# EAGLE design POVDisplayRoateBasic (EAGLE 7.4.0)
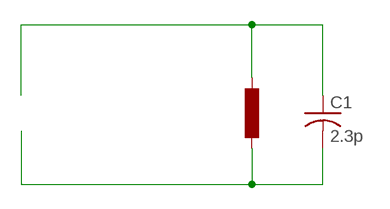
[diagram p0: schematic, sheet 1]
L1 (L): INDUCTANCE: 36.2uH

## Parts
C1  2.3p  C-USC1210  [C1210]

## Nets
NEG_COIL: C1.2
POS_COIL: C1.1

## Library data of the parts
C1 = resistor:C-US: CAPACITOR, American symbol

## Board
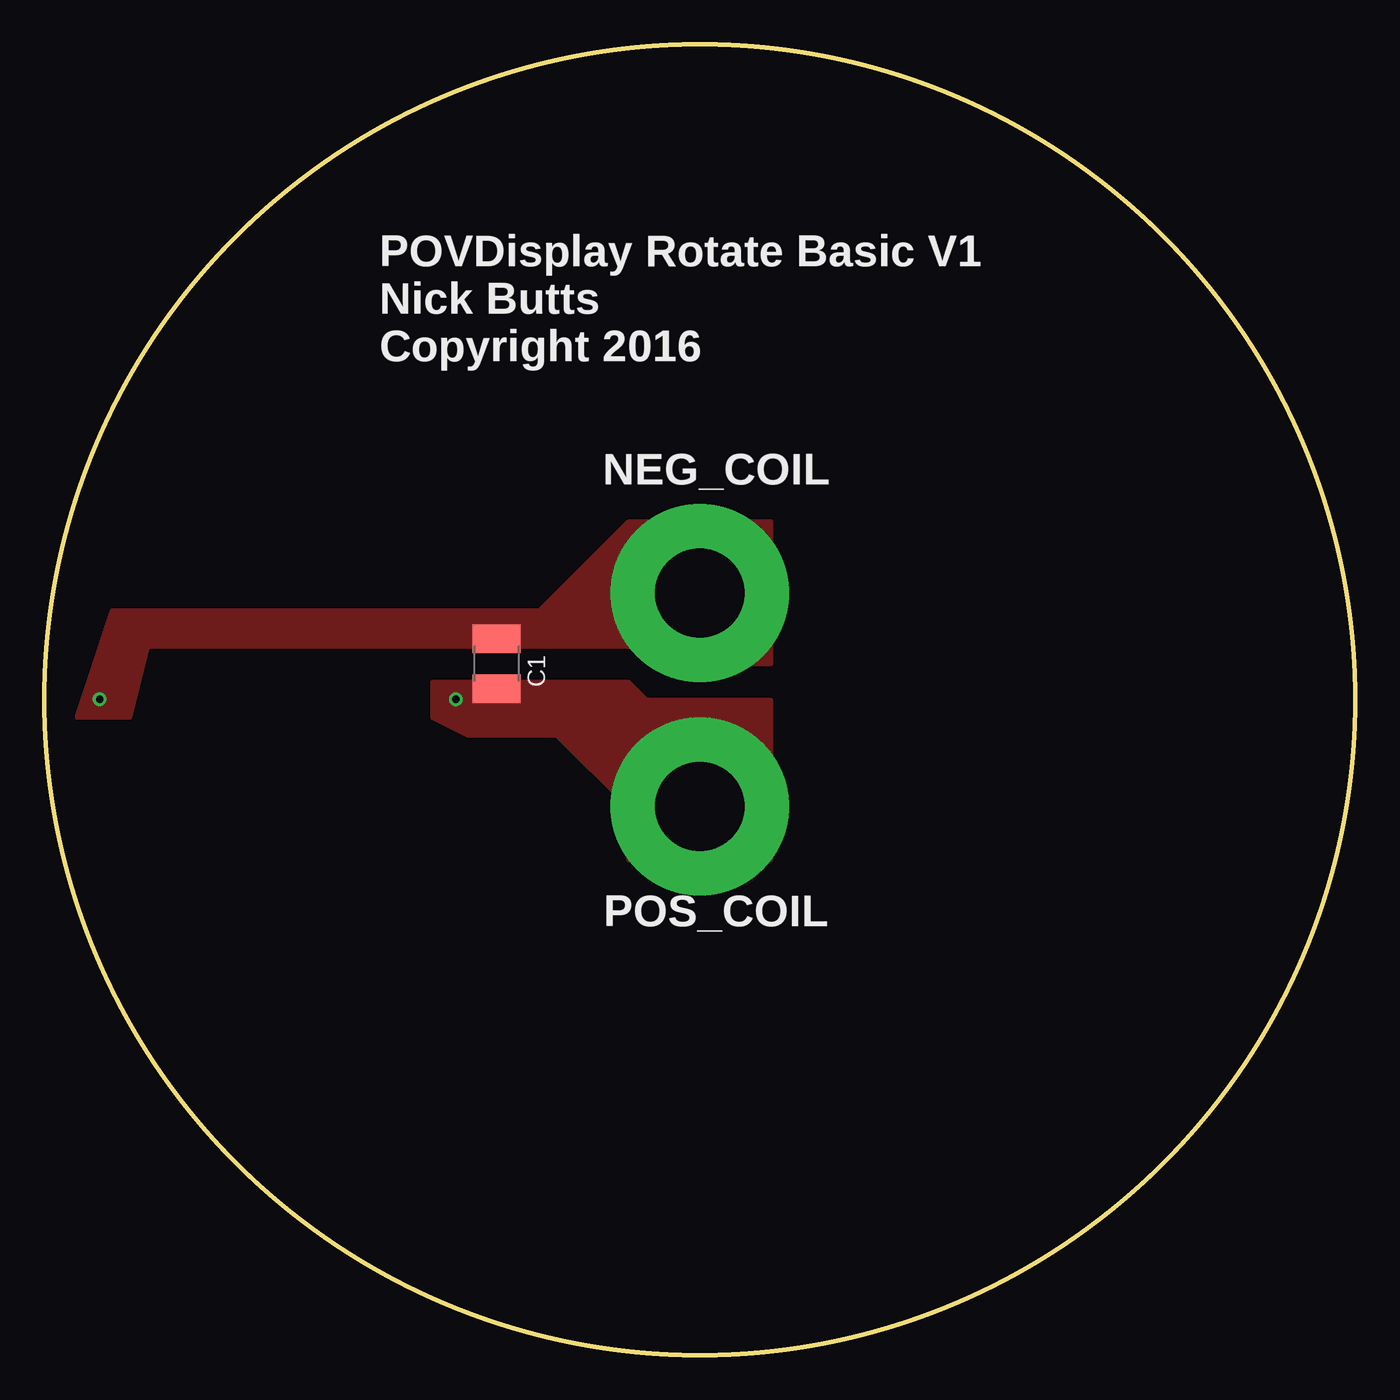
[diagram p1: board, top side]
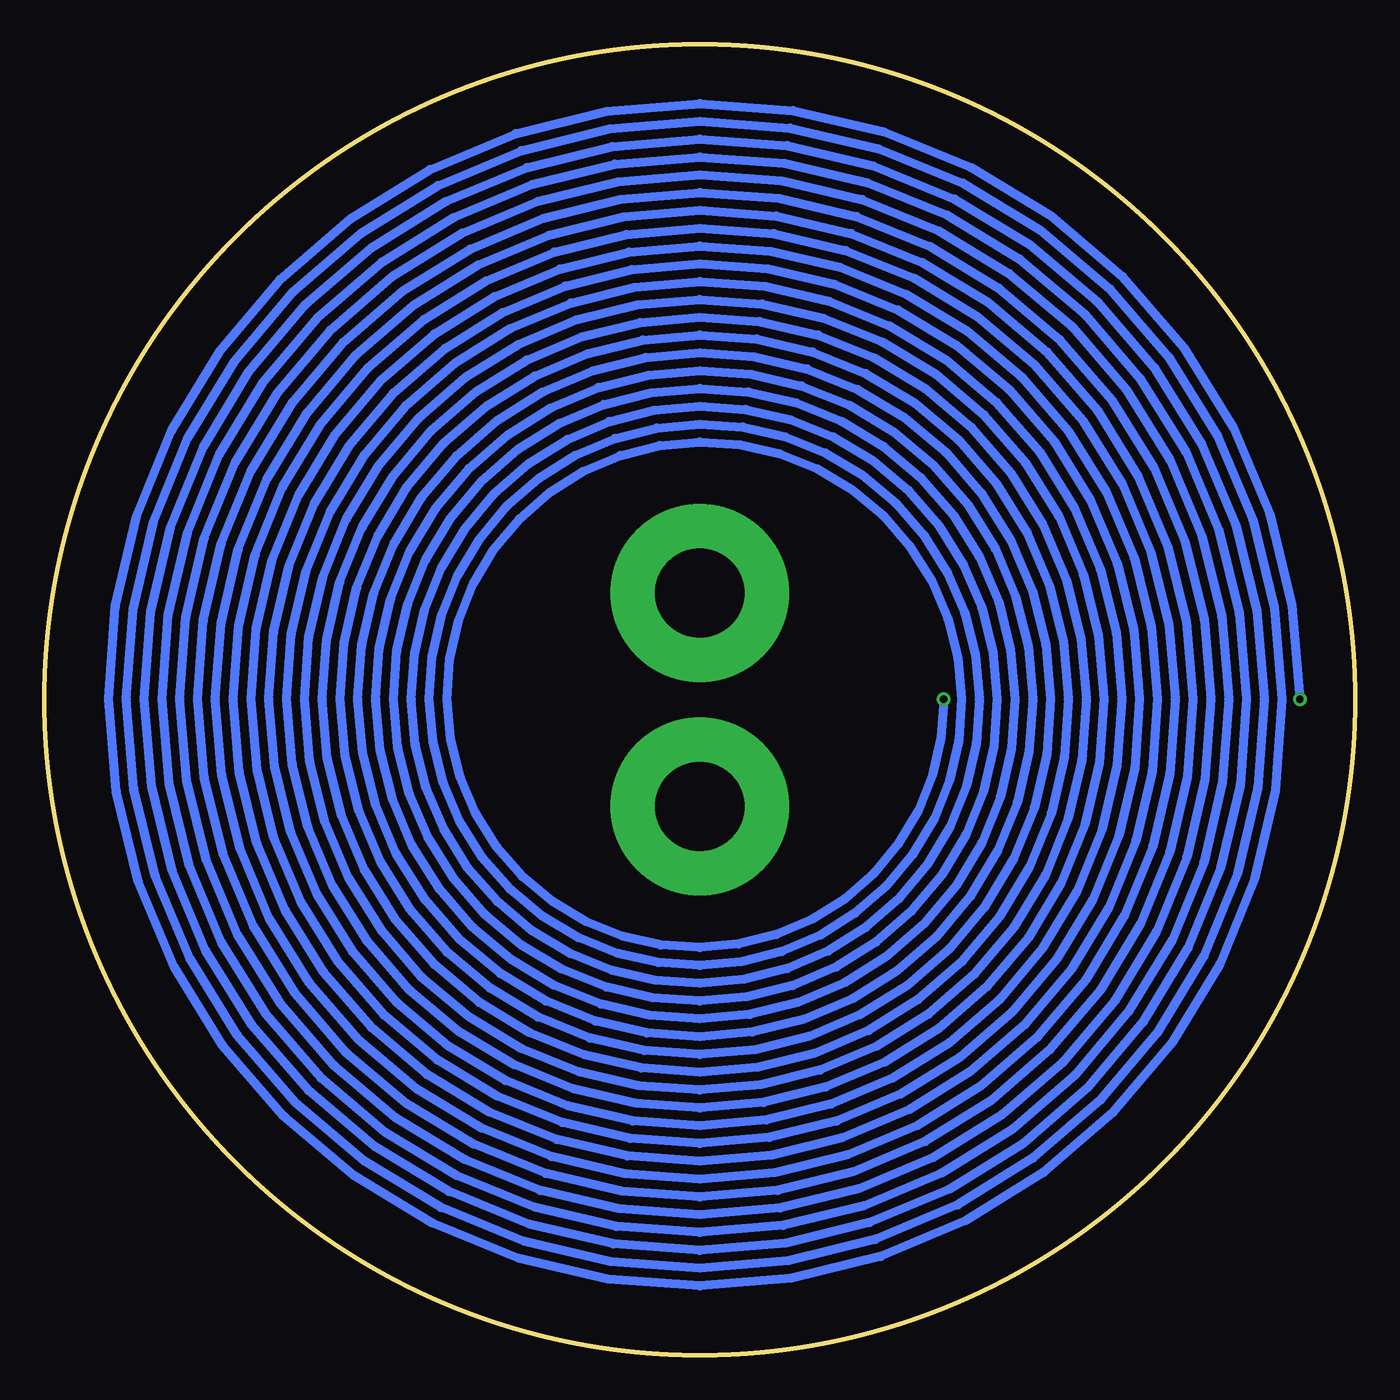
[diagram p2: board, bottom side, seen from below]

Size 73.59 x 73.59 mm. Coordinates in mm from the lower left corner, seen from the top.
Outline: circle at 36.8,36.8 radius 36.8
Copper layers (1*16): Top 0.0356mm / dielectric 1.5011mm / Bottom 0.0356mm
Design rules "oshpark-2layer": minimum track width 6mil, minimum drill 13mil, track to track 6mil, track to pad 6mil, pad to pad 6mil, via to via 6mil, smd to smd 6mil, copper to edge 15mil, drill to drill 6mil, minimum pad ring 7mil, minimum via ring 7mil, stop-mask expansion 4mil, vias tented up to drill 0mil, thermal gap 10mil

### Footprints (pad centres in the part's own frame; a part is rotated, then mirrored left to right if it is on the bottom)
C1210 = smd 1.6 x 2.7: 1 -1.4,0; 2 1.4,0

### Placement (x,y rotation side)
C1  25.4,38.83 90 top

### Tracks (layer width: path | path; a pad name or v marks a point on that pad's centre or on a via)
NEG_COIL  (via drill 0.4 pad 0.5, 5 pad 10)
  Bottom 0.5: v23.1,36.83 23.24,34.68 23.72,32.58 24.52,30.57 25.63,28.72 27.02,27.05 28.66,25.62 30.5,24.46 32.5,23.61 34.62,23.07 36.8,22.88 38.98,23.02 41.12,23.51 43.16,24.33 45.05,25.46 46.75,26.87 48.2,28.54 49.38,30.41 50.25,32.45 50.8,34.61 51,36.83 50.85,39.05 50.35,41.23 49.52,43.31 48.37,45.23 46.93,46.96 45.23,48.44 43.32,49.63 41.25,50.52 39.05,51.07 36.8,51.28 34.53,51.12 32.32,50.62 30.2,49.77 28.24,48.6 26.49,47.13 24.98,45.41 23.77,43.47 22.86,41.35 22.3,39.12 22.1,36.83 22.25,34.52 22.77,32.27 23.63,30.12 24.82,28.13 26.31,26.34 28.07,24.81 30.04,23.57 32.19,22.66 34.46,22.09 36.8,21.88 39.14,22.04 41.43,22.56 43.62,23.44 45.64,24.65 47.46,26.17 49.01,27.95 50.27,29.96 51.2,32.14 51.78,34.45 52,36.83 51.83,39.21 51.3,41.54 50.41,43.76 49.17,45.82 47.63,47.66 45.82,49.24 43.78,50.53 41.56,51.47 39.21,52.06 36.8,52.28 34.38,52.11 32.01,51.57 29.75,50.66 27.66,49.41 25.78,47.84 24.18,46 22.87,43.92 21.91,41.66 21.31,39.28 21.1,36.83 21.27,34.37 21.82,31.96 22.74,29.66 24.01,27.54 25.61,25.64 27.48,24 29.59,22.68 31.88,21.7 34.31,21.1 36.8,20.88 39.3,21.05 41.74,21.61 44.07,22.55 46.23,23.84 48.16,25.46 49.82,27.36 51.16,29.51 52.16,31.84 52.77,34.3 53,36.83 52.82,39.36 52.25,41.85 51.3,44.22 49.98,46.41 48.34,48.37 46.41,50.05 44.23,51.42 41.86,52.42 39.37,53.05 36.8,53.28 34.22,53.1 31.7,52.52 29.29,51.55 27.07,50.22 25.08,48.55 23.37,46.58 21.98,44.37 20.96,41.97 20.33,39.44 20.1,36.83 20.28,34.21 20.87,31.65 21.85,29.21 23.21,26.95 24.9,24.93 26.89,23.19 29.14,21.79 31.57,20.75 34.15,20.11 36.8,19.88 39.45,20.06 42.05,20.66 44.53,21.66 46.82,23.03 48.87,24.75 50.63,26.78 52.05,29.05 53.11,31.53 53.76,34.14 54,36.83 53.81,39.52 53.2,42.16 52.19,44.67 50.79,47 49.05,49.08 46.99,50.86 44.68,52.31 42.17,53.37 39.52,54.04 36.8,54.28 34.06,54.09 31.39,53.47 28.84,52.44 26.48,51.02 24.37,49.25 22.56,47.17 21.09,44.83 20.01,42.28 19.34,39.59 19.1,36.83 19.29,34.05 19.92,31.34 20.96,28.76 22.4,26.36 24.19,24.22 26.3,22.39 28.68,20.9 31.27,19.8 33.99,19.12 36.8,18.88 39.61,19.07 42.36,19.71 44.98,20.77 47.41,22.22 49.58,24.05 51.44,26.19 52.95,28.6 54.06,31.22 54.75,33.98 55,36.83 54.8,39.68 54.15,42.47 53.08,45.12 51.6,47.58 49.75,49.78 47.58,51.67 45.14,53.2 42.48,54.33 39.68,55.02 36.8,55.28 33.91,55.07 31.08,54.42 28.39,53.33 25.89,51.83 23.66,49.96 21.75,47.76 20.2,45.28 19.06,42.59 18.35,39.75 18.1,36.83 18.3,33.9 18.96,31.03 20.07,28.3 21.59,25.78 23.49,23.52 25.72,21.58 28.23,20.01 30.96,18.85 33.84,18.13 36.8,17.88 39.76,18.09 42.67,18.76 45.43,19.88 47.99,21.41 50.28,23.34 52.25,25.6 53.84,28.14 55.01,30.91 55.74,33.83 56,36.83 55.78,39.83 55.1,42.78 53.97,45.58 52.41,48.17 50.46,50.49 48.17,52.48 45.59,54.09 42.79,55.28 39.84,56.01 36.8,56.28 33.75,56.06 30.77,55.37 27.93,54.22 25.31,52.64 22.95,50.67 20.94,48.35 19.31,45.74 18.11,42.9 17.36,39.9 17.1,36.83 17.31,33.74 18.01,30.72 19.18,27.85 20.78,25.19 22.78,22.81 25.13,20.77 27.77,19.12 30.65,17.9 33.68,17.15 36.8,16.88 39.92,17.1 42.98,17.81 45.89,18.98 48.58,20.61 50.99,22.63 53.06,25.01 54.73,27.69 55.96,30.6 56.72,33.67 57,36.83 56.77,39.99 56.06,43.08 54.86,46.03 53.22,48.76 51.17,51.2 48.76,53.29 46.05,54.98 43.1,56.23 39.99,57 36.8,57.28 33.59,57.05 30.46,56.32 27.48,55.11 24.72,53.45 22.25,51.38 20.13,48.93 18.42,46.19 17.16,43.21 16.38,40.06 16.1,36.83 16.33,33.58 17.06,30.41 18.29,27.39 19.97,24.6 22.07,22.1 24.54,19.96 27.32,18.23 30.34,16.95 33.52,16.16 36.8,15.88 40.08,16.11 43.29,16.85 46.34,18.09 49.17,19.8 51.7,21.92 53.87,24.42 55.62,27.24 56.91,30.29 57.71,33.51 58,36.83 57.76,40.15 57.01,43.39 55.75,46.49 54.03,49.35 51.88,51.91 49.35,54.1 46.5,55.87 43.41,57.18 40.15,57.99 36.8,58.28 33.44,58.04 30.15,57.27 27.02,56.01 24.13,54.26 21.54,52.08 19.32,49.52 17.53,46.64 16.21,43.52 15.39,40.22 15.1,36.83 15.34,33.43 16.11,30.11 17.39,26.94 19.16,24.01 21.36,21.39 23.95,19.15 26.87,17.34 30.03,16 33.37,15.17 36.8,14.88 40.23,15.12 43.59,15.9 46.8,17.2 49.76,18.99 52.41,21.22 54.68,23.84 56.51,26.78 57.86,29.98 58.7,33.36 59,36.83 58.75,40.3 57.96,43.7 56.64,46.94 54.84,49.93 52.58,52.61 49.93,54.91 46.95,56.76 43.72,58.13 40.3,58.98 36.8,59.28 33.28,59.02 29.84,58.23 26.57,56.9 23.54,55.07 20.83,52.79 18.51,50.11 16.64,47.1 15.26,43.83 14.4,40.37 14.1,36.83 14.35,33.27 15.16,29.8 16.5,26.49 18.35,23.43 20.66,20.69 23.37,18.34 26.41,16.44 29.72,15.05 33.21,14.18 36.8,13.88 40.39,14.13 43.9,14.95 47.25,16.31 50.34,18.18 53.11,20.51 55.48,23.25 57.4,26.33 58.81,29.67 59.69,33.2 60,36.83 59.74,40.46 58.91,44.01 57.53,47.39 55.65,50.52 53.29,53.32 50.52,55.72 47.41,57.65 44.03,59.08 40.46,59.96 36.8,60.28 33.12,60.01 29.53,59.18 26.12,57.79 22.95,55.88 20.13,53.5 17.7,50.7 15.75,47.55 14.3,44.13 13.41,40.53 13.1,36.83 13.36,33.12 14.21,29.49 15.61,26.03 17.54,22.84 19.95,19.98 22.78,17.53 25.96,15.55 29.41,14.1 33.05,13.2 36.8,12.88 40.55,13.15 44.21,14 47.7,15.42 50.93,17.37 53.82,19.8 56.29,22.66 58.29,25.87 59.76,29.36 60.67,33.04 61,36.83 60.72,40.62 59.86,44.32 58.43,47.85 56.46,51.11 54,54.03 51.11,56.53 47.86,58.54 44.34,60.03 40.62,60.95 36.8,61.28 32.97,61 29.23,60.13 25.66,58.68 22.37,56.69 19.42,54.2 16.89,51.29 14.86,48.01 13.35,44.44 12.43,40.69 12.1,36.83 12.38,32.96 13.26,29.18 14.72,25.58 16.73,22.25 19.24,19.27 22.19,16.72 25.5,14.66 29.1,13.15 32.9,12.21 36.8,11.88 40.7,12.16 44.52,13.05 48.16,14.53 51.52,16.56 54.53,19.1 57.1,22.07 59.18,25.42 60.72,29.05 61.66,32.89 62,36.83 61.71,40.77 60.81,44.63 59.32,48.3 57.26,51.7 54.7,54.73 51.7,57.34 48.32,59.44 44.65,60.98 40.77,61.94 36.8,62.28 32.81,61.99 28.92,61.08 25.21,59.57 21.78,57.5 18.71,54.91 16.09,51.87 13.96,48.46 12.4,44.75 11.44,40.84 11.1,36.83 11.39,32.8 12.31,28.87 13.83,25.12 15.92,21.66 18.54,18.57 21.6,15.91 25.05,13.77 28.79,12.19 32.74,11.22 36.8,10.88 40.86,11.17 44.83,12.1 48.61,13.64 52.11,15.75 55.23,18.39 57.91,21.49 60.07,24.97 61.67,28.75 62.65,32.73 63,36.83 62.7,40.93 61.76,44.94 60.21,48.76 58.07,52.29 55.41,55.44 52.28,58.14 48.77,60.33 44.95,61.93 40.93,62.93 36.8,63.28 32.65,62.98 28.61,62.03 24.75,60.46 21.19,58.31 18.01,55.62 15.28,52.46 13.07,48.91 11.45,45.06 10.45,41 10.1,36.83 10.4,32.65 11.36,28.56 12.94,24.67 15.11,21.07 17.83,17.86 21.01,15.1 24.6,12.88 28.48,11.24 32.58,10.23 36.8,9.88 41.02,10.18 45.14,11.15 49.07,12.75 52.7,14.94 55.94,17.68 58.72,20.9 60.97,24.51 62.62,28.44 63.64,32.58 64,36.83 63.69,41.09 62.71,45.25 61.1,49.21 58.88,52.87 56.12,56.15 52.87,58.95 49.22,61.22 45.26,62.89 41.09,63.91 36.8,64.28 32.5,63.96 28.3,62.98 24.3,61.35 20.6,59.11 17.3,56.32 14.47,53.05 12.18,49.37 10.5,45.37 9.46,41.16 9.1,36.83 9.41,32.49 10.4,28.25 12.05,24.22 14.31,20.49 17.12,17.15 20.43,14.3 24.14,11.99 28.17,10.29 32.43,9.25 36.8,8.88 41.17,9.2 45.45,10.2 49.52,11.86 53.28,14.13 56.65,16.97 59.53,20.31 61.86,24.06 63.57,28.13 64.62,32.42 65,36.83 64.67,41.24 63.66,45.56 61.99,49.66 59.69,53.46 56.83,56.86 53.46,59.76 49.68,62.11 45.57,63.84 41.24,64.9 36.8,65.28 32.34,64.95 27.99,63.93 23.85,62.24 20.02,59.92 16.59,57.03 13.66,53.64 11.29,49.82 9.55,45.68 8.47,41.31 8.1,36.83 8.43,32.33 9.45,27.94 11.16,23.76 13.5,19.9 16.41,16.44 19.84,13.49 23.69,11.1 27.87,9.34 32.27,8.26 36.8,7.88 41.33,8.21 45.76,9.25 49.97,10.97 53.87,13.32 57.36,16.27 60.34,19.72 62.75,23.6 64.52,27.82 65.61,32.26 66,36.83 65.66,41.4 64.61,45.87 62.88,50.12 60.5,54.05 57.53,57.56 54.05,60.57 50.13,63 45.88,64.79 41.4,65.89 36.8,66.28 32.19,65.94 27.68,64.88 23.39,63.13 19.43,60.73 15.88,57.74 12.85,54.22 10.4,50.28 8.6,45.99 7.49,41.47 7.1,36.83 7.44,32.18 8.5,27.63 10.27,23.31 12.69,19.31 15.71,15.74 19.25,12.68 23.23,10.21 27.56,8.39 32.12,7.27 36.8,6.88 41.49,7.22 46.07,8.29 50.43,10.07 54.46,12.52 58.06,15.56 61.15,19.13 63.64,23.15 65.47,27.51 66.6,32.11 67,36.83 66.65,41.55 65.57,46.17 63.77,50.57 61.31,54.64 58.24,58.27 54.64,61.38 50.59,63.89 46.19,65.74 41.56,66.88 36.8,67.28 32.03,66.93 27.37,65.83 22.94,64.02 18.84,61.54 15.18,58.45 12.04,54.81 9.51,50.73 7.65,46.3 6.5,41.63 6.1,36.83 6.45,32.02 7.55,27.32 9.38,22.85 11.88,18.72 15,15.03 18.66,11.87 22.78,9.32 27.25,7.44 31.96,6.28 36.8,5.88 41.64,6.23 46.38,7.34 50.88,9.18 55.05,11.71 58.77,14.85 61.96,18.55 64.53,22.7 66.42,27.2 67.59,31.95 68,36.83 67.64,41.71 66.52,46.48 64.66,51.03 62.12,55.22 58.95,58.98 55.22,62.19 51.04,64.78 46.5,66.69 41.71,67.86 36.8,68.28 31.87,67.91 27.06,66.78 22.48,64.92 18.25,62.35 14.47,59.15 11.23,55.4 8.62,51.18 6.7,46.61 5.51,41.78 5.1,36.83 5.46,31.86 6.6,27.02 8.48,22.4 11.07,18.13 14.29,14.32 18.08,11.06 22.33,8.43 26.94,6.49 31.8,5.29 36.8,4.88 41.8,5.25 46.69,6.39 51.34,8.29 55.64,10.9 59.48,14.15 62.77,17.96 65.42,22.24 67.37,26.89 68.58,31.79 69,36.83 68.62,41.87 67.47,46.79 65.55,51.48 62.93,55.81 59.65,59.68 55.81,63 51.49,65.67 46.81,67.64 41.87,68.85 36.8,69.28 31.72,68.9 26.75,67.74 22.03,65.81 17.66,63.16 13.76,59.86 10.42,55.99 7.73,51.64 5.74,46.92 4.52,41.94 4.1,36.83 4.47,31.71 5.65,26.71 7.59,21.95 10.26,17.55 13.59,13.62 17.49,10.25 21.87,7.53 26.63,5.54 31.65,4.31 36.8,3.88 41.95,4.26 46.99,5.44 51.79,7.4 56.22,10.09 60.18,13.44 63.57,17.37 66.31,21.79 68.32,26.58 69.56,31.64 70,36.83 69.61,42.02 68.42,47.1 66.44,51.93 63.74,56.4 60.36,60.39 56.4,63.81 51.95,66.56 47.12,68.59 42.03,69.84 36.8,70.28 31.56,69.89 26.44,68.69 21.58,66.7 17.08,63.97 13.06,60.57 9.61,56.58 6.84,52.09 4.79,47.22 3.54,42.09 v3.1,36.83
  other vias: 36.8,42.8
  pour Top (no thermals): 1.8,35.8 4.8,35.8 5.8,39.8 33.8,39.8 34.8,38.8 40.8,38.8 40.8,46.8 32.8,46.8 27.8,41.8 3.8,41.8
  pour Top: 21.8,37.8 23.8,37.8 23.8,35.8 21.8,35.8
POS_COIL  (via drill 5 pad 10)
  other vias: 36.8,30.8
  pour Top (no thermals): 21.8,35.8 21.8,37.8 32.8,37.8 33.8,36.8 40.8,36.8 40.8,27.8 32.8,27.8 32.8,30.8 28.8,34.8 23.8,34.8

### Text on the board
tNames: POVDisplay Rotate Basic V1 / Nick Butts / Copyright 2016 | NEG_COIL | POS_COIL